# Altium schematic sheet CPLD.SchDoc: Скальпель
size A3; Address1: (с) Быканов Андрей; Address2: г.Тула 2016г.; Revision: 1.3
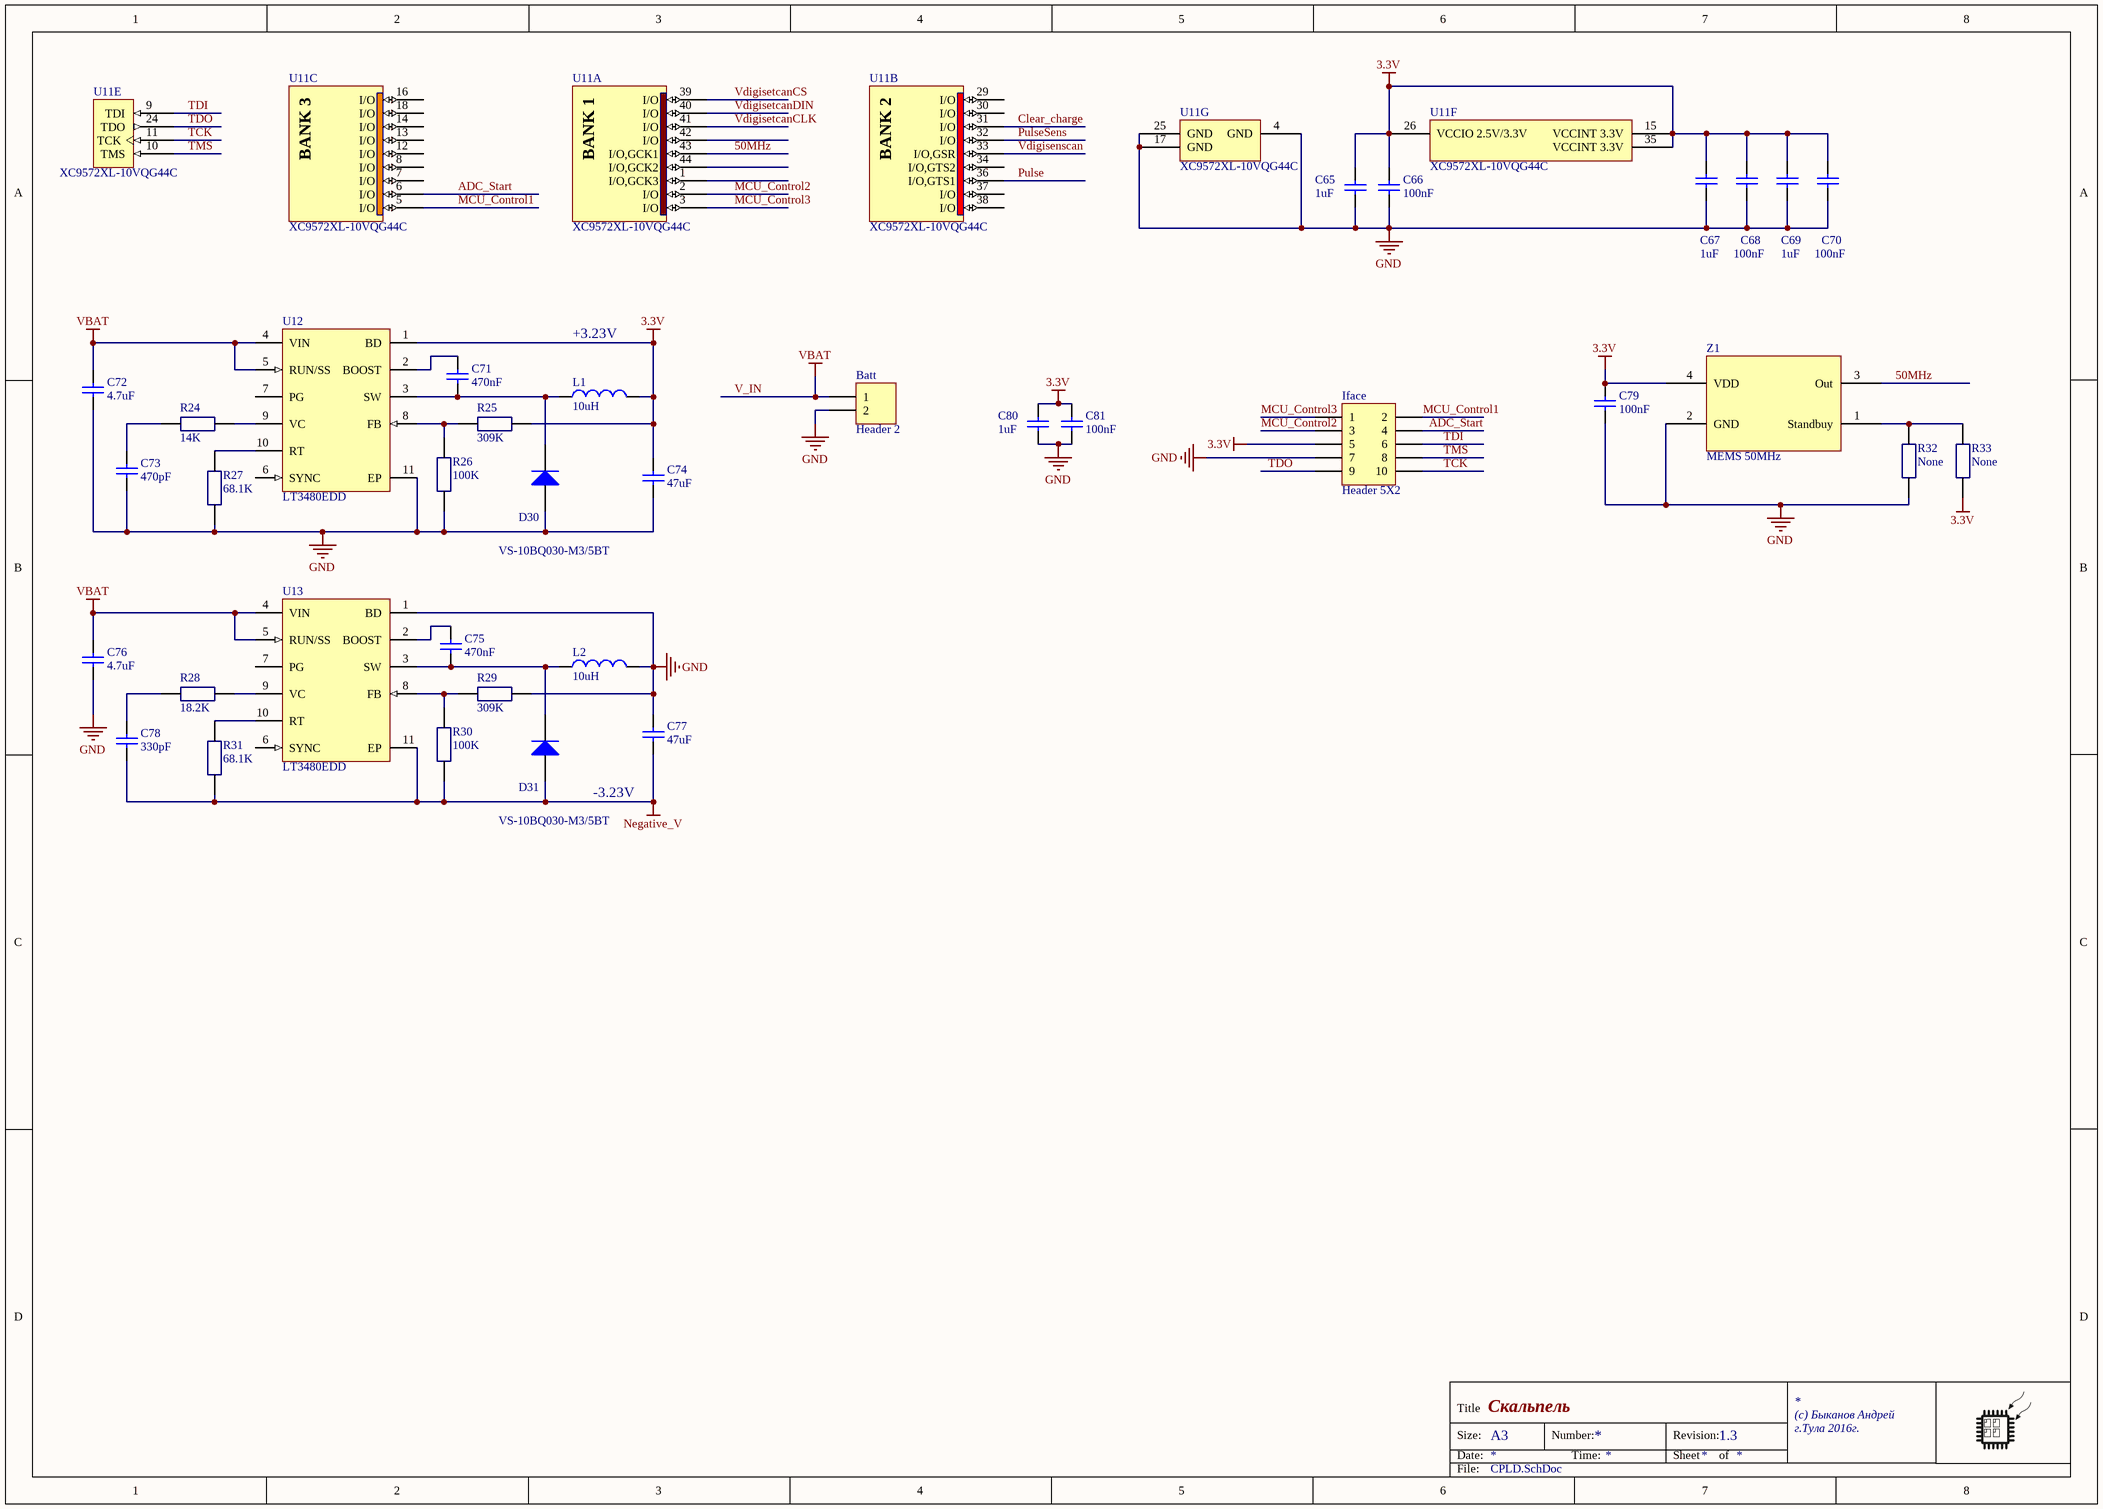
[diagram p0: CPLD.SchDoc]

## Parts
Batt  Header 2  [HDR1X2]  (no BOM)
C65  1uF  [1608[0603]_CAP]
C66  100nF  [1608[0603]_CAP]
C67  1uF  [1608[0603]_CAP]
C68  100nF  [1608[0603]_CAP]
C69  1uF  [1608[0603]_CAP]
C70  100nF  [1608[0603]_CAP]
C71  470nF  [1608[0603]_CAP]
C72  4.7uF  [C1206]
C73  470pF  [1608[0603]_CAP]
C74  47uF  [C1206]
C75  470nF  [1608[0603]_CAP]
C76  4.7uF  [C1206]
C77  47uF  [C1206]
C78  330pF  [1608[0603]_CAP]
C79  100nF  [1608[0603]_CAP]
C80  1uF  [1608[0603]_CAP]
C81  100nF  [1608[0603]_CAP]
D30  VS-10BQ030-M3/5BT  [SMB]
D31  VS-10BQ030-M3/5BT  [SMB]
Iface  Header 5X2  [HDR2X5]  (no BOM)
L1  10uH  [SLF10145]
L2  10uH  [SLF10145]
R24  14K  [1608[0603]_RES]
R25  309K  [1608[0603]_RES]
R26  100K  [1608[0603]_RES]
R27  68.1K  [1608[0603]_RES]
R28  18.2K  [1608[0603]_RES]
R29  309K  [1608[0603]_RES]
R30  100K  [1608[0603]_RES]
R31  68.1K  [1608[0603]_RES]
R32  None  [0402 Yageo]  (no BOM)
R33  None  [0402 Yageo]  (no BOM)
U11  XC9572XL-10VQG44C  [VQG44_N]  (parts A,B,C,E,F,G of 7)
U12  LT3480EDD  [LT-DD-10_V]
U13  LT3480EDD  [LT-DD-10_V]
Z1  MEMS 50MHz  [asdmb]

## Nets
3.3V: C65.1 C66.1 C67.1 C68.1 C69.1 C70.1 C74.1 C79.1 C80.1 C81.1 Iface.5 L1.2 R25.2 R33.1(A) U11.15(VCCINT_3.3V) U11.26(VCCIO_2.5V/3.3V) U11.35(VCCINT_3.3V) U12.1(BD) Z1.4(VDD)
GND: Batt.2 C65.2 C66.2 C67.2 C68.2 C69.2 C70.2 C72.2 C73.2 C74.2 C76.2 C77.1 C79.2 C80.2 C81.2 D30.1(A) Iface.7 L2.2 R26.1(A) R27.1(A) R29.2 R32.1(A) U11.4(GND) U11.17(GND) U11.25(GND) U12.11(EP) U13.1(BD) Z1.2(GND)
Negative_V: C77.2 C78.2 D31.1(A) R30.1(A) R31.1(A) U13.11(EP)
V_IN: Batt.1 C72.1 C76.1 U12.4(VIN) U12.5(RUN/SS) U13.4(VIN) U13.5(RUN/SS)  [also labelled VBAT]
50MHz: U11.43(I/O,GCK1) Z1.3(Out)
ADC_Start: Iface.4 U11.6(I/O)
Clear_charge: U11.31(I/O)
MCU_Control1: Iface.2 U11.5(I/O)
MCU_Control2: Iface.3 U11.2(I/O)
MCU_Control3: Iface.1 U11.3(I/O)
Pulse: U11.36(I/O,GTS1)
PulseSens: U11.32(I/O)
TCK: Iface.10 U11.11(TCK)
TDI: Iface.6 U11.9(TDI)
TDO: Iface.9 U11.24(TDO)
TMS: Iface.8 U11.10(TMS)
Vdigisenscan: U11.33(I/O,GSR)
VdigisetcanCLK: U11.41(I/O)
VdigisetcanCS: U11.39(I/O)
VdigisetcanDIN: U11.40(I/O)
NetC71_1: C71.1 U12.2(BOOST)
NetC71_2: C71.2 D30.2(K) L1.1 U12.3(SW)
NetC73_1: C73.1 R24.1(A)
NetC75_1: C75.1 U13.2(BOOST)
NetC75_2: C75.2 D31.2(K) L2.1 U13.3(SW)
NetC78_1: C78.1 R28.1(A)
NetR24_2: R24.2 U12.9(VC)
NetR25_1: R25.1(A) R26.2 U12.8(FB)
NetR27_2: R27.2 U12.10(RT)
NetR28_2: R28.2 U13.9(VC)
NetR29_1: R29.1(A) R30.2 U13.8(FB)
NetR31_2: R31.2 U13.10(RT)
NetR32_2: R32.2 R33.2 Z1.1(Standbuy)

Not connected (* = marked no-connect by the designer): U11 1(I/O,GCK3) 7(I/O) 8(I/O) 12(I/O) 13(I/O) 14(I/O) 16(I/O) 18(I/O) 29(I/O) 30(I/O) 34(I/O,GTS2) 37(I/O) 38(I/O) 42(I/O) 44(I/O,GCK2); U12 6(SYNC) 7(PG); U13 6(SYNC) 7(PG)

## Notes on the sheet
- +3.23V
- -3.23V
- Title
- Size:
- Date:
- A3
- Number:
- Time:
- Revision:
- Sheet
- of
- File:
- (in symbol XC9572XL-10VQG44C, part A) BANK 1
- (in symbol XC9572XL-10VQG44C, part B) BANK 2
- (in symbol XC9572XL-10VQG44C, part C) BANK 3

## Library data of the parts
Batt = Header 2: Header, 2-Pin; LatestRevisionDate: 17-Jul-2002; LatestRevisionNote: Re-released for DXP Platform.; Publisher: Altium Limited
C65 C67 C69 C80 = Cap Semi: Capacitor (Semiconductor SIM Model); Order: CC0603KRX5R7BB105; Published: 8-Jun-2000; LatestRevisionDate: 29-May-2009; LatestRevisionNote: IPC-7351 Footprint Added.; PackageReference: C1206; Publisher: Altium Limited; PackageDescription: Chip Capacitor; Value: 1uF
C66 C68 C70 C79 C81 = Cap Semi: Capacitor (Semiconductor SIM Model); Order: GRM188R72A104KA35D; Published: 8-Jun-2000; LatestRevisionDate: 29-May-2009; LatestRevisionNote: IPC-7351 Footprint Added.; PackageReference: C1206; Publisher: Altium Limited; PackageDescription: Chip Capacitor; Value: 100nF
C71 C75 = Cap Semi: Capacitor (Semiconductor SIM Model); Order: GRM188R71C474KA88D; Published: 8-Jun-2000; LatestRevisionDate: 29-May-2009; LatestRevisionNote: IPC-7351 Footprint Added.; PackageReference: C1206; Publisher: Altium Limited; PackageDescription: Chip Capacitor; Value: 470nF
C72 C76 = Cap Semi: Capacitor (Semiconductor SIM Model); Order: GRM31CR71A475KA01L; Published: 8-Jun-2000; LatestRevisionDate: 29-May-2009; LatestRevisionNote: IPC-7351 Footprint Added.; PackageReference: C1206; Publisher: Altium Limited; PackageDescription: Chip Capacitor; Value: 4.7uF
C73 = Cap Semi: Capacitor (Semiconductor SIM Model); Order: CC0603JRNPO9BN471; Published: 8-Jun-2000; LatestRevisionDate: 29-May-2009; LatestRevisionNote: IPC-7351 Footprint Added.; PackageReference: C1206; Publisher: Altium Limited; PackageDescription: Chip Capacitor; Value: 470pF
C74 C77 = Cap Semi: Capacitor (Semiconductor SIM Model); Order: GRM31CR61A476ME15L; Published: 8-Jun-2000; LatestRevisionDate: 29-May-2009; LatestRevisionNote: IPC-7351 Footprint Added.; PackageReference: C1206; Publisher: Altium Limited; PackageDescription: Chip Capacitor; Value: 47uF
C78 = Cap Semi: Capacitor (Semiconductor SIM Model); Order: GRM1885C1H331JA01D; Published: 8-Jun-2000; LatestRevisionDate: 29-May-2009; LatestRevisionNote: IPC-7351 Footprint Added.; PackageReference: C1206; Publisher: Altium Limited; PackageDescription: Chip Capacitor; Value: 330pF
D30 D31 = Diode: Default Diode; Published: 8-Jun-2000; LatestRevisionDate: 17-Jul-2002; LatestRevisionNote: Re-released for DXP Platform.; PackageVersion: Sep-1996; PackageReference: SMC; Publisher: Altium Limited; PackageDescription: DO-214-AB/SMC; 2 C-Bend Leads; Body 7.9 x 5.9 mm, inc. leads (LxW); Code_JEDEC: DO-214-AB; Order: VS-10BQ030-M3/5BT; Value: VS-10BQ030-M3/5BT
Iface = Header 5X2: Header, 5-Pin, Dual row; LatestRevisionDate: 17-Jul-2002; LatestRevisionNote: Re-released for DXP Platform.; Publisher: Altium Limited
L1 L2 = Inductor: Code_IEC: 1005; Order: SLF10145T-100M2R5-PF; Published: 8-Jun-2000; LatestRevisionDate: 29-May-2009; LatestRevisionNote: IPC-7351 Footprint Added.; PackageReference: 0402-A; Publisher: Altium Limited; PackageDescription: Chip Inductor; Code_JEITA: 0402; Value: 10uH
R24 = Resistor 0805: Order: ERA-3AEB1402V; Avail: 20; Value: 14K
R25 R29 = Resistor 0805: Order: ERA-3AEB3093V; Avail: 20; Value: 309K
R26 R30 = Resistor 0805: Order: ERA-3AEB104V; Avail: 20; Value: 100K
R27 R31 = Resistor 0805: Order: ERA-3AEB6812V; Avail: 20; Value: 68.1K
R28 = Resistor 0805: Order: ERA-3AEB1822V; Avail: 20; Value: 18.2K
R32 R33 = Resistor 0805: Avail: 20; Order: None; Value: None
U11 = XC9572XL-10VQG44C: FastFLASH XC900XL, 3.3V High-Performance 72 Macrocell CPLD, 34 User I/Os, 44-Pin VQFP, Speed Grade 10, Commercial Grade, Pb-Free; Published: 8-Sep-2006; LatestRevisionDate: 18-Nov-2009; LatestRevisionNote: Updated to datasheet version 2.5 May-2009.; DatasheetVersion: ver2.0 Apr-2007; PackageVersion: ver1.2, Jun-2004; PackageReference: VQG44; Publisher: Altium Limited; PackageDescription: 44-Pin Very Thin Quad Flat Pack (VQG44) - Pb-Free; Supplier 1: Digi-Key; Supplier Part Number 1: 122-1448-ND; Supplier 2: Farnell; Supplier Part Number 2: 1605849; Supplier 3: Newark; Supplier Part Number 3: 12N2472; Code_JEDEC: MS-026-ACB; ComponentLink1Description: XC9572XL Datasheet; ComponentLink1URL: http://www.xilinx.com/support/documentation/data_sheets/ds057.pdf; ComponentLink2Description: VQG44 Package Drawing; ComponentLink2URL: http://www.xilinx.com/support/documentation/package_specs/vq44.pdf; ComponentLink3Description: XC9500XL Documents; ComponentLink3URL: http://www.xilinx.com/support/documentation/xc9500xl.htm; ComponentLink4Description: Xilinx.com Home; ComponentLink4URL: http://www.xilinx.com; Order: XC9572XL-10VQG44C
U12 U13 = LT3480EDD#PBF: 2 A, 2.4 MHz Step-Down Switching Regulator with 70 uA Quiescent Current, 10-pin SON (DD-10), -40 to 85 degC, Pb-Free; Manufacturer: Linear Technology; Number of Outputs: 1; Over Voltage Protection(V): 60; PackageVersion: Rev. C, 06/2010; PackageReference: DD-10; PackageDescription: 10-Pin Plastic DFN, Body 3 x 3 mm, Pitch 0.5 mm; Supplier 1: Digi-Key; Supplier Part Number 1: LT3480EDD#PBF-ND; Supplier 2: Farnell; Supplier Part Number 2: 1663561; Supplier 3: Newark; Supplier Part Number 3: 57M8341; RoHS: TRUE; Mounting Technology: Surface Mount; Code_JEDEC: MO-229; PartNumber: LT3480EDD#PBF; ComponentLink1Description: Manufacturer URL; ComponentLink1URL: http://www.linear.com/; ComponentLink2Description: Datasheet; ComponentLink2URL: http://cds.linear.com/docs/en/datasheet/3480fe.pdf; ComponentLink3Description: Package Specification; ComponentLink3URL: http://cds.linear.com/docs/en/packaging/DFN_10_05-08-1699.pdf; Order: LT3480EDD
Z1 = ASEMB: Order: ASDMB-50.000MHZ-LC-T